# Altium schematic sheet Drive.SchDoc
size 203 x 101 mm; SheetNumber: 2; SheetTotal: 5
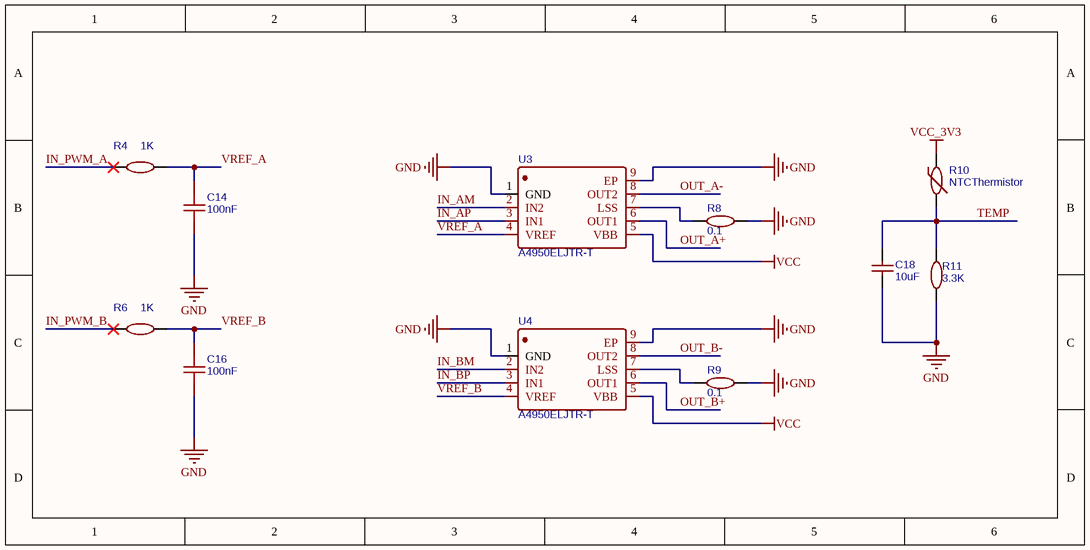
[diagram p0: Drive.SchDoc]

## Parts
C14  100nF  [C0603]
C16  100nF  [C0603]
C18  10uF  [C1206]
R4  1K  [R0603]
R6  1K  [R0603]
R8  0.1  [R1206]
R9  0.1  [R1206]
R10  NTCThermistor  [R0402]
R11  3.3K  [R0603_NEW]
U3  A4950ELJTR-T  [SOIC-8_L4.9-W3.9-P1.27-LS6.0-BL-EP]
U4  A4950ELJTR-T  [SOIC-8_L4.9-W3.9-P1.27-LS6.0-BL-EP]

## Nets
GND: C14.1 C16.1 C18.1 R8.2 R9.2 R11.1 U3.1(GND) U3.9(EP) U4.1(GND) U4.9(EP)
VCC: U3.5(VBB) U4.5(VBB)
VCC_3V3: R10.1
IN_AM: U3.2(IN2)
IN_AP: U3.3(IN1)
IN_BM: U4.2(IN2)
IN_BP: U4.3(IN1)
IN_PWM_A: R4.1
IN_PWM_B: R6.1
OUT_A+: U3.6(OUT1)
OUT_A-: U3.8(OUT2)
OUT_B+: U4.6(OUT1)
OUT_B-: U4.8(OUT2)
TEMP: C18.2 R10.2 R11.2
VREF_A: C14.2 R4.2 U3.4(VREF)
VREF_B: C16.2 R6.2 U4.4(VREF)
NetR8_1: R8.1 U3.7(LSS)
NetR9_1: R9.1 U4.7(LSS)

## Library data of the parts
C14 C16 = 100nF: BOM_Manufacturer: SAMSUNG; BOM_Manufacturer Part: CL10B104KB8NNNC; nameAlias: Capacitance; BOM_Supplier: LCSC; BOM_Supplier Part: C1591; BOM_JLCPCB Part Class: Extended Part; spicePre: C; spiceSymbolName: CL10B104KB8NNNC
C18 = 10uF: BOM_Manufacturer Part: CL31A106KBHNNNE; BOM_Manufacturer: SAMSUNG; nameAlias: Capacitance; BOM_Supplier: LCSC; BOM_Supplier Part: C13585; BOM_JLCPCB Part Class: Basic Part; spicePre: C; spiceSymbolName: CL31A106KBHNNNE
R4 R6 = 1K: BOM_Manufacturer: UniOhm; BOM_Manufacturer Part: 0603WAF1001T5E; nameAlias: Resistance (Ohms); BOM_Supplier: LCSC; BOM_Supplier Part: C21190; BOM_JLCPCB Part Class: Basic Part; spicePre: R; spiceSymbolName: 0603WAF1001T5E
R8 R9 = 0.1: BOM_Manufacturer: UniOhm; BOM_Manufacturer Part: 1206W4F100LT5E; nameAlias: Resistance (Ohms); BOM_Supplier: LCSC; BOM_Supplier Part: C25334; BOM_JLCPCB Part Class: Basic Part; spicePre: R; spiceSymbolName: 1206W4F100LT5E
R10 = NTCThermistor: BOM_Manufacturer: MuRata; BOM_Manufacturer Part: NCP15XH103F03RC; nameAlias: Value; BOM_Supplier: LCSC; BOM_Supplier Part: C77131; BOM_JLCPCB Part Class: Extended Part; spicePre: R; spiceSymbolName: NCP15XH103F03RC
R11 = 3.3K: BOM_Manufacturer: UniOhm; BOM_Manufacturer Part: 0603WAF3301T5E; nameAlias: Resistance (Ohms); BOM_Supplier: LCSC; BOM_Supplier Part: C22978; BOM_JLCPCB Part Class: Basic Part; spicePre: R; spiceSymbolName: 0603WAF3301T5E
U3 U4 = A4950ELJTR-T: BOM_Manufacturer: ALLEGRO; BOM_Supplier: LCSC; BOM_Manufacturer Part: A4950ELJTR-T; BOM_Supplier Part: C82404; BOM_JLCPCB Part Class: Extended Part; spicePre: U; spiceSymbolName: A4950ELJTR-T